# EAGLE design Arduino-Pro-Mini (EAGLE 8.0.1)
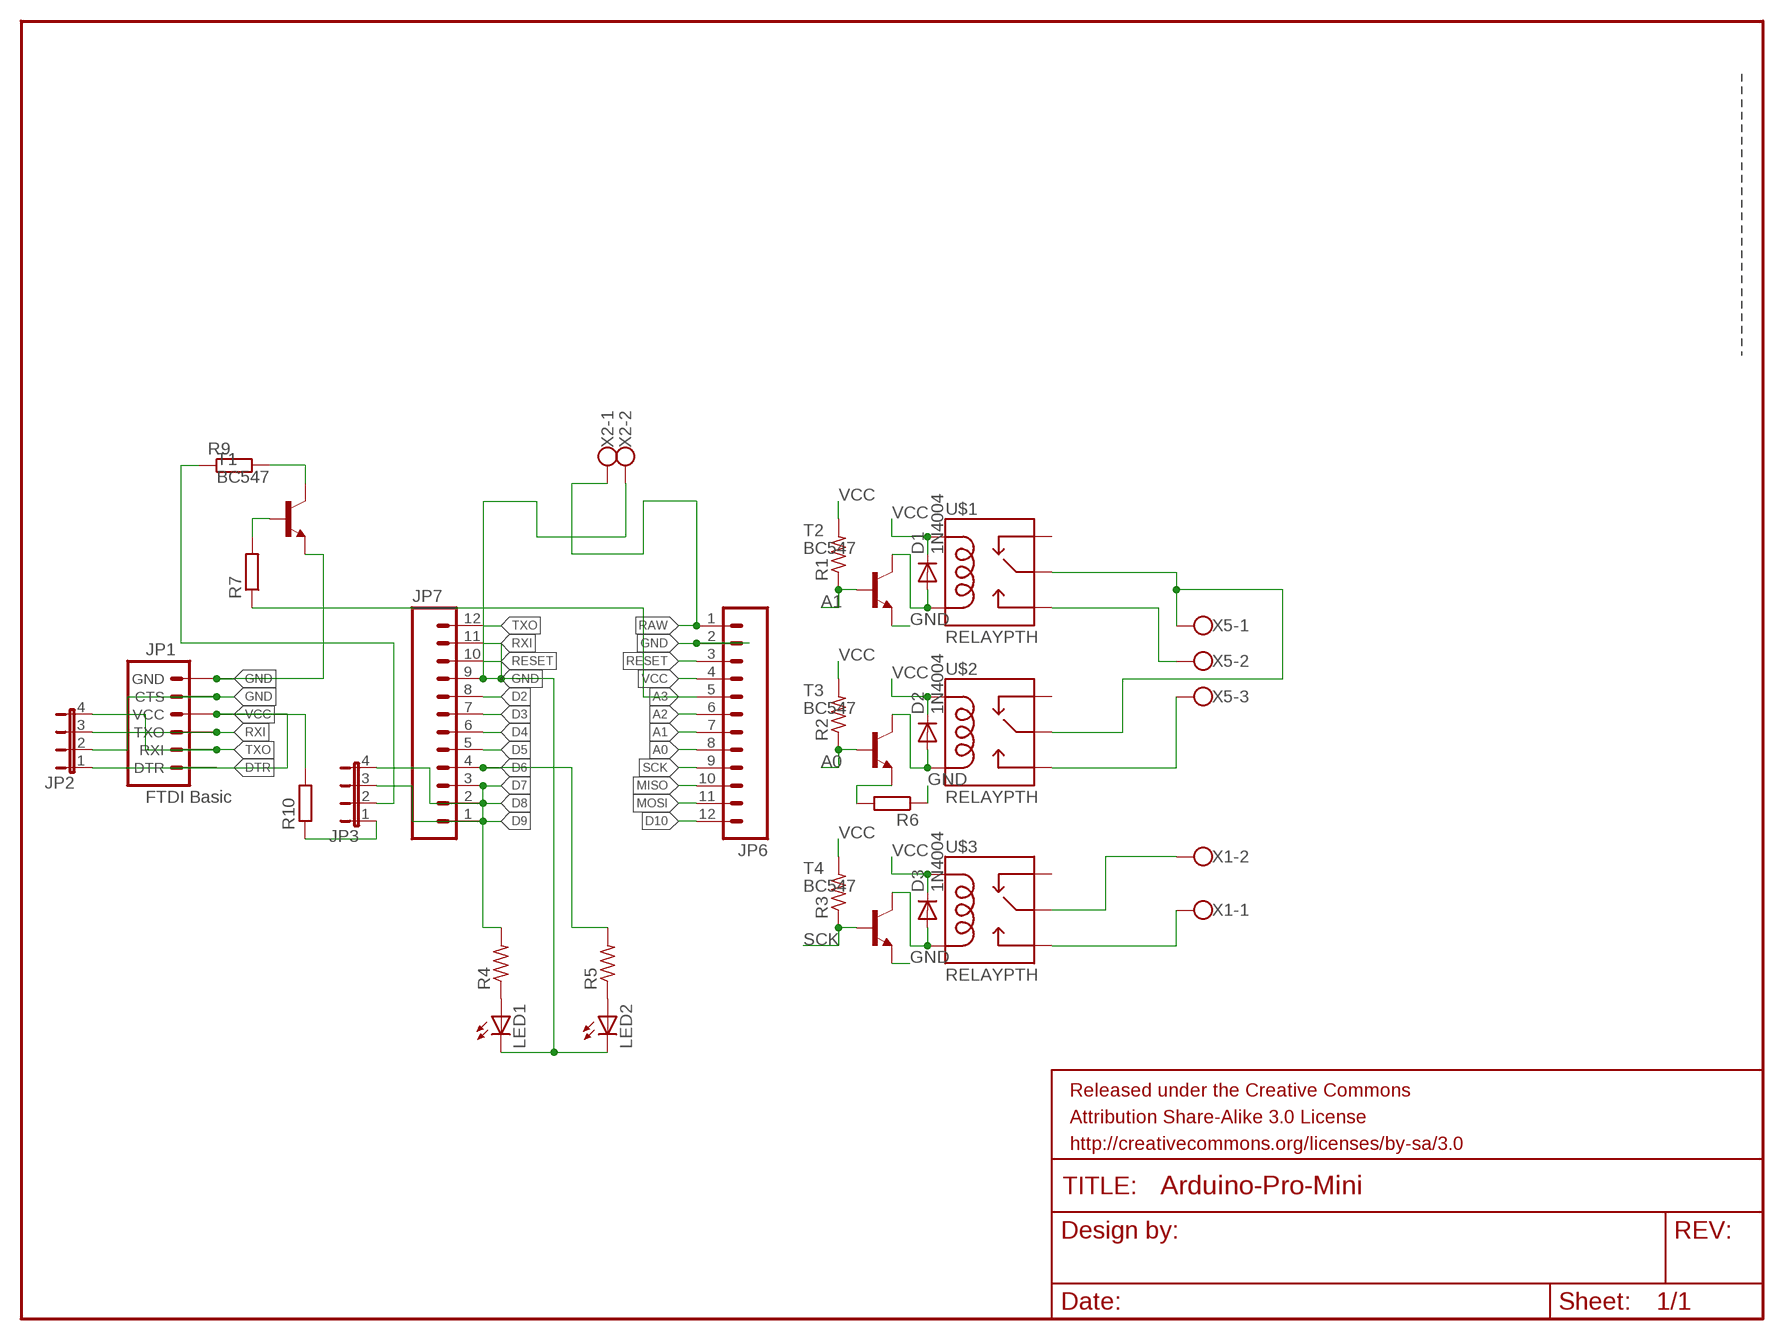
[diagram p0: schematic, sheet 1]

## Parts
D1  1N4004  [DO41-10]
D2  1N4004  [DO41-10]
D3  1N4004  [DO41-10]
FRAME1  FRAME-LETTER  [CREATIVE_COMMONS]
JP1  FTDI Basic  ARDUINO_SERIAL_PROGRAMPTH  [1X06]
JP2  JP4E  [JP4]
JP3  JP4E  [JP4]
JP6  M12PTH  [1X12]
JP7  M12PTH  [1X12]
LED1  LED3MM  [LED3MM]
LED2  LED3MM  [LED3MM]
R1  R-US_0204/5  [0204/5]
R2  R-US_0204/5  [0204/5]
R3  R-US_0204/5  [0204/5]
R4  FLIPFLOP-RES  [0805-THM]
R5  FLIPFLOP-RES  [0805-THM]
R6  RR1206  [R1206]
R7  R0204/7  [0204/7]
R9  RR0603  [R0603]
R10  RR1206  [R1206]
T1  BC547  [TO92]
T2  BC547  [TO92]
T3  BC547  [TO92]
T4  BC547  [TO92]
U$1  RELAYPTH  [SRD-05VDC-SL-C]
U$2  RELAYPTH  [SRD-05VDC-SL-C]
U$3  RELAYPTH  [SRD-05VDC-SL-C]
X1  W237-102  [W237-102]
X2  W237-102  [W237-102]
X5  W237-103  [W237-103]

## Nets
A0: JP6.8 R2.1 T3.2(B)
A1: JP6.7 R1.1 T2.2(B)
A2: JP6.6
A3: JP6.5 R7.1
D2: JP7.8
D3: JP7.7
D4: JP7.6
D5: JP7.5
D6: JP7.4 R5.2
D7: JP7.3 R4.2
D8: JP3.4 JP7.2
D9: JP3.3 JP7.1
D10: JP6.12
DTR: JP1.1(DTR)
GND [vcc]: JP1.5(CTS) JP1.6(GND) JP2.2 JP6.2 JP7.9 LED1.K(C) LED2.K(C) R6.1 R6.2 T1.1(E) T2.1(E) T3.1(E) T4.1(E) X2.2
MISO: JP6.10
MOSI: JP6.11
N$1: U$1.SWCOMMON U$2.SWCOMMON X5.1
N$2: U$1.SWOPEN X5.2
N$3: U$2.SWOPEN X5.3
N$4: D3.A T4.3(C) U$3.COIL0
N$5: D2.A T3.3(C) U$2.COIL0
N$6: D1.A T2.3(C) U$1.COIL0
N$7: U$3.SWCOMMON X1.2
N$8: U$3.SWOPEN X1.1
N$10: LED1.A R4.1
N$11: LED2.A R5.1
N$13: JP3.2 R9.1
N$14: R7.2 T1.2(B)
N$15: JP3.1 R10.1
N$16: R9.2 T1.3(C)
RAW [vcc]: JP6.1 X2.1
RESET: JP6.3 JP7.10
RXI: JP1.3(TXO) JP2.3 JP7.11
SCK: JP6.9 R3.1 T4.2(B)
TXO: JP1.2(RXI) JP2.4 JP7.12
VCC: D1.C D2.C D3.C JP1.4(VCC) JP2.1 JP6.4 R1.2 R2.2 R3.2 R10.2 U$1.COIL1 U$2.COIL1 U$3.COIL1
Unconnected: U$1.SWCLOSED(SWCLOSE) U$2.SWCLOSED(SWCLOSE) U$3.SWCLOSED(SWCLOSE)

## Library data of the parts
D1-D3 = adafruit:1N4004: DIODE General purpose 1N400x type rectifier (With bigger pads) http://www.ladyada.net/library/pcb/eaglelibrary.html
FRAME1 = SparkFun-Aesthetics:FRAME-LETTER: Schematic Frame Standard 8.5x11 US Letter frame
JP1 = SparkFun:ARDUINO_SERIAL_PROGRAM
JP2 JP3 = jumper:JP4E: JUMPER
JP6 JP7 = SparkFun:M12: Header 12 Standard 12-pin 0.1" header. Use with straight break away headers (SKU : PRT-00116), right angle break away headers (PRT-00553), swiss pins (PRT-00743), machine pins (PRT-00117), and female headers (PRT-00115).
LED1 LED2 = led:LED: LED OSRAM: - CHIPLED LG R971, LG N971, LY N971, LG Q971, LY Q971, LO R971, LY R971 LH N974, LH R974 LS Q976, LO Q976, LY Q976 LO Q996 - Hyper CHIPLED LW Q18S LB Q993, LB Q99A, LB R99A - SideLED LS A670, LO A670, LY A670, LG A670, LP A670 LB A673, LV A673, LT A673, LW A673 LH A674 LY A675 LS A676, LA A676, LO A676, LY A676, LW A676 LS A679, LY A679, LG A679 - Hyper Micro SIDELED® LS Y876, LA Y876, LO Y876, LY Y876 LT Y87S - SmartLED LW L88C, LW L88S LB L89C, LB L89S, LG L890 LS L89K, LO L89K, LY L89K LS L896, LA L896, LO L896, LY L896 - TOPLED LS T670, LO T670, LY T670, LG T670, LP T670 LSG T670, LSP T670, LSY T670, LOP T670, LYG T670 LG T671, LOG T671, LSG T671 LB T673, LV T673, LT T673, LW T673 LH T674 LS T676, LA T676, LO T676, LY T676, LB T676, LH T676, LSB T676, LW T676 LB T67C, LV T67C, LT T67C, LS T67K, LO T67K, LY T67K, LW E67C LS E67B, LA E67B, LO E67B, LY E67B, LB E67C, LV E67C, LT E67C LW T67C LS T679, LY T679, LG T679 LS T770, LO T770, LY T770, LG T770, LP T770 LB T773, LV T773, LT T773, LW T773 LH T774 LS E675, LA E675, LY E675, LS T675 LS T776, LA T776, LO T776, LY T776, LB T776 LHGB T686 LT T68C, LB T68C - Hyper Mini TOPLED® LB M676 - Mini TOPLED Santana® LG M470 LS M47K, LO M47K, LY M47K Source: http://www.osram.convergy.de LUXEON: - LUMILED® LXK2-PW12-R00, LXK2-PW12-S00, LXK2-PW14-U00, LXK2-PW14-V00 LXK2-PM12-R00, LXK2-PM12-S00, LXK2-PM14-U00 LXK2-PE12-Q00, LXK2-PE12-R00, LXK2-PE12-S00, LXK2-PE14-T00, LXK2-PE14-U00 LXK2-PB12-K00, LXK2-PB12-L00, LXK2-PB12-M00, LXK2-PB14-N00, LXK2-PB14-P00, LXK2-PB14-Q00 LXK2-PR12-L00, LXK2-PR12-M00, LXK2-PR14-Q00, LXK2-PR14-R00 LXK2-PD12-Q00, LXK2-PD12-R00, LXK2-PD12-S00 LXK2-PH12-R00, LXK2-PH12-S00 LXK2-PL12-P00, LXK2-PL12-Q00, LXK2-PL12-R00 Source: www.luxeon.com KINGBRIGHT: KA-3528ASYC Source: www.kingbright.com
R1-R3 = adafruit:R-US_: RESISTOR, American symbol
R4 R5 = adafruit:FLIPFLOP-RES: Flip Flop resistor An 0805 resistor inside a standard 1/4W 5% resistor. Makes for easy mods
R6 R7 R9 R10 = eagle-ltspice:R: RESISTOR, European symbol; SPICEMODEL: NONE; SPICEPREFIX: R
T1-T4 = transistor:BC547: NPN TRANSISTOR
U$1-U$3 = SRD-05VDC-SL-C:RELAY: SPDT relay (COM-00101)
X1 X2 = con-wago-500:W237-102: WAGO SCREW CLAMP; MPN: 237-102; OC_FARNELL: unknown; OC_NEWARK: 70K9898
X5 = con-wago-500:W237-103: WAGO SCREW CLAMP; MPN: 237-103; OC_FARNELL: unknown; OC_NEWARK: 18M7116

## Net classes
0 default: width 0.203 mm
1 vcc: width 0.254 mm

## Board
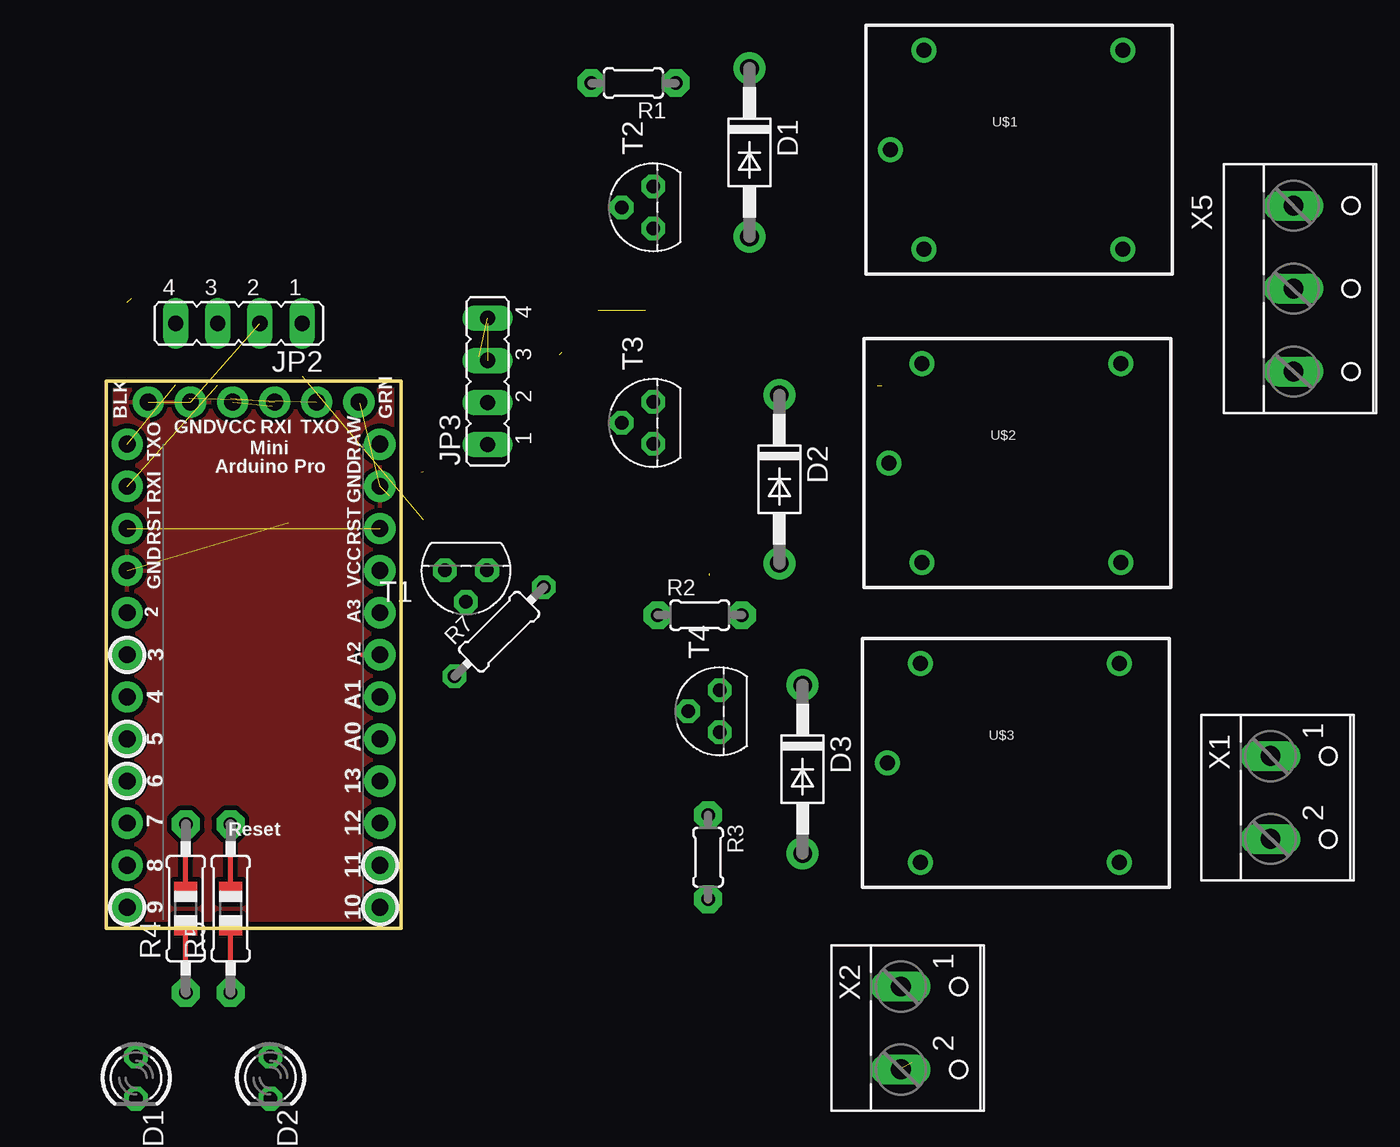
[diagram p1: board, top side]
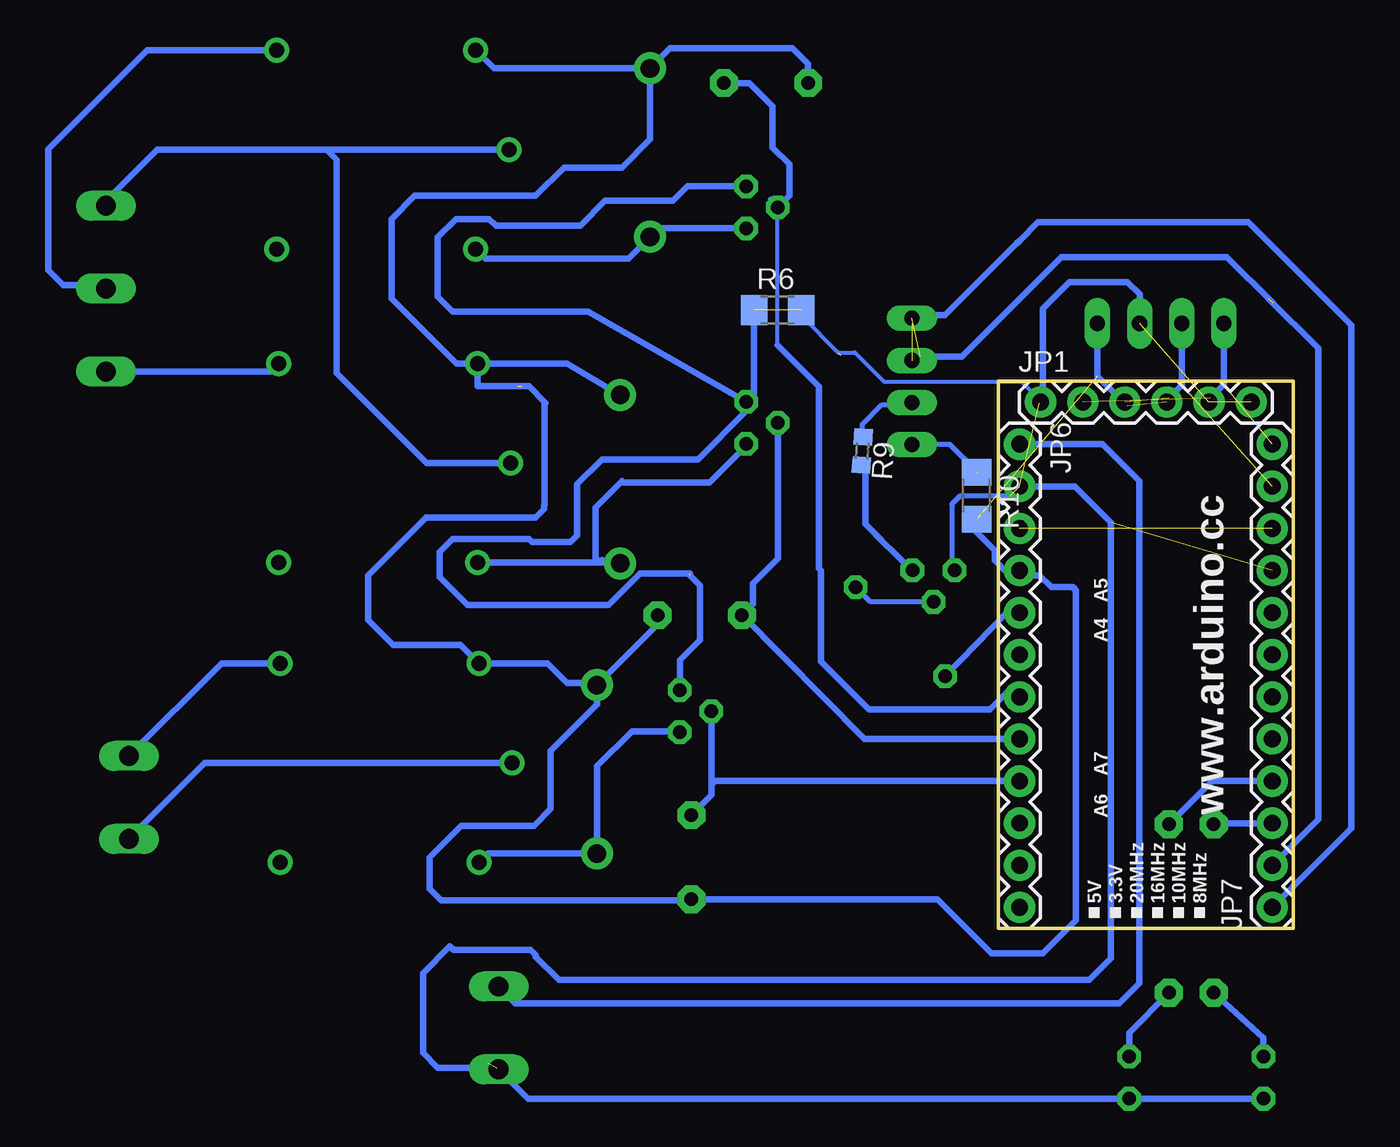
[diagram p2: board, bottom side, seen from below]

Size 17.78 x 33.02 mm. Coordinates in mm from the lower left corner, seen from the top.
Outline: 0,33.02 0,0 17.78,0 17.78,33.02 0,33.02
Copper layers (1*16): Top 0.035mm / dielectric 1.5mm / Bottom 0.035mm
Design rules "SparkFun-2-layer *": minimum track width 7mil, minimum drill 15mil, track to track 8mil, track to pad 8mil, pad to pad 8mil, via to via 8mil, smd to smd 8mil, copper to edge 8mil, drill to drill 8mil, minimum pad ring 12mil, minimum via ring 10mil, stop-mask expansion 4mil, vias tented up to drill 20mil, thermal gap 10mil

### Footprints (pad centres in the part's own frame; a part is rotated, then mirrored left to right if it is on the bottom)
DO41-10 = drill 1.118 pad 1.93: A 5.08,0; C -5.08,0
1X06 = drill 1.016 pad 1.88: 1 0,0; 2 2.54,0; 3 5.08,0; 4 7.62,0; 5 10.16,0; 6 12.7,0
JP4 = drill 0.914 long: 1 -3.81,0; 2 -1.27,0; 3 1.27,0; 4 3.81,0
1X12 = drill 1.016 pad 1.88: 1 0,0; 2 2.54,0; 3 5.08,0; 4 7.62,0; 5 10.16,0; 6 12.7,0; 7 15.24,0; 8 17.78,0; 9 20.32,0; 10 22.86,0; 11 25.4,0; 12 27.94,0
LED3MM = drill 0.813 octagon: A -1.27,0; K 1.27,0
0204/5 = drill 0.813 pad 1.676 octagon: 1 -2.54,0; 2 2.54,0
0805-THM = drill 0.813 pad 1.676 octagon: 1 -5.08,0; 2 5.08,0
R1206 = smd 1.6 x 1.803: 1 -1.422,0; 2 1.422,0
0204/7 = drill 0.813 octagon: 1 -3.81,0; 2 3.81,0
R0603 = smd 1 x 1.1: 1 -0.85,0; 2 0.85,0
TO92 = drill 0.813 octagon: 1 1.27,0; 2 0,1.905; 3 -1.27,0
SRD-05VDC-SL-C = drill 0.9: COIL0 -5.39,-6.12; COIL1 -5.39,5.88; SWCLOSED 6.61,-6.12; SWCOMMON -7.39,-0.12; SWOPEN 6.61,5.88
W237-102 = drill 1.194 long: 1 -2.5,-1.27; 2 2.5,-1.27
W237-103 = drill 1.194 long: 1 -5,-1.29; 2 0,-1.29; 3 5,-1.29

### Placement (x,y rotation side)
D1  38.8,46.8 270 top  (outside the outline)
D2  40.6,27.1 270 top  (outside the outline)
D3  42,9.6 270 top  (outside the outline)
FRAME1  -13.48,-9.39 0 top  (outside the outline)
JP1  15.24,31.75 0 bottom
JP2  8,36.5 180 top  (outside the outline)
JP3  23,33 90 top  (outside the outline)
JP6  16.51,29.21 270 bottom
JP7  1.27,1.27 90 bottom
LED1  1.8,-9 270 top  (outside the outline)
LED2  9.9,-9 270 top  (outside the outline)
R1  31.8,51 180 top  (outside the outline)
R2  35.8,18.9 0 top  (outside the outline)
R3  36.3,4.3 270 top  (outside the outline)
R4  4.8,1.2 90 top
R5  7.5,1.2 90 top
R6  31.1,37.3 0 bottom  (outside the outline)
R7  23.7,17.9 45 top  (outside the outline)
R9  26,28.8 266.3 bottom  (outside the outline)
R10  19.1,26.1 270 bottom
T1  21.7,21.6 180 top
T2  33,43.5 90 top  (outside the outline)
T3  33,30.5 90 top  (outside the outline)
T4  37,13.1 90 top  (outside the outline)
U$1  54.7,47.1 0 top  (outside the outline)
U$2  54.6,28.2 0 top  (outside the outline)
U$3  54.5,10.1 0 top  (outside the outline)
X1  71.5,7.9 270 top  (outside the outline)
X2  49.2,-6 270 top  (outside the outline)
X5  72.9,38.6 270 top  (outside the outline)

### Tracks (layer width: path | path; a pad name or v marks a point on that pad's centre or on a via)
A0
  Bottom 0.406: JP6.8 25.87,11.43 R2.1 32.6,19.56 32.6,20.8 31.09,22.3 T3.2
A1
  Bottom 0.254: 31.1,35.2 31.1,43.54 31.52,43.95
  Bottom 0.406: 31.52,43.95 T2.2 30.4,44.2 30.4,46.1 31.4,47.1 31.4,49.6 32.8,51 R1.1 | JP6.7 16.74,14.2 17.3,14.2 18.3,13.2 25.6,13.2 28.5,16.1 28.5,21.6 28.6,21.7 28.6,32.7 31.1,35.2
A2
  Top 0.254: 15.39,16.51 JP6.6
A3
  Top 0.254: 16.51,18.76 JP6.5 16.51,18.76
  Bottom 0.406: JP6.5 17.26,19.05 R7.1
D6
  Bottom 0.406: JP7.4 4.89,8.89 R5.2
D7
  Bottom 0.406: JP7.3 4.15,6.35 4.8,5.7 R4.2
D8  (2 unrouted)
  Bottom 0.406: 1.5,38 -1.5,35 -1.5,6.58 JP7.2 | 1.25,37.75 4,40.5 14,40.5 20,34.5 22.5,34.5 23,34
D9  (1 unrouted)
  Bottom 0.406: JP7.1 -3.5,6.04 -3.5,36.4 2.7,42.6 15.4,42.6 16.5,41.5 16.7,41.3 21,37 22.5,37 23,36.5
GND  (9 unrouted)
  Bottom 0.254: R6.2 29.68,36.98 27.45,34.75 26.45,34.75 24.7,33 16.4,33 15.1,31.7
  Bottom 0.305: 17.08,26.1 20.1,26.1 20.6,25.6 20.6,21.77 T1.1
  Bottom 0.406: JP2.2 9.27,38.27 10,39 13.5,39 15.1,37.4 15.1,31.7 15.3,31.7 15.2,31.8 | LED1.K LED2.K 46.16,-10.27 X2.2 48.03,-8.4 51.6,-8.4 52.5,-7.5 52.5,-2.7 50.88,-1.08 50.66,-1.3 46,-1.3 45.7,-1.6 45.7,-1.7 44.3,-3.1 12.3,-3.1 11,-1.8 11,24.5 13.17,26.67 JP6.2 | 48.9,-8.4 48.6,-8.1 | 36.4,21.3 35.8,20.7 35.8,17.4 37,16.2 T4.1 37,14.5 | T2.1 36.53,44.77 37.4,43.9 41.5,43.9 43,42.4 48.1,42.4 48.5,42.8 50.5,42.8 51.6,41.7 51.6,38.1 50.7,37.2 42.53,37.2 T3.1 | 36.4,21.4 39.4,21.4 41.3,19.5 49.8,19.5 51.5,21.2 51.5,22.7 50.7,23.5 46.1,23.5 45.9,23.3 43.6,23.3 43.2,23.7 43.2,26.8 41.7,28.3 35.9,28.3 33,31.2 T3.1 | R6.1 32.52,32.25 T3.1
  pour Top (isolate 0.305): 0,33.02 17.78,33.02 17.78,0 0,0
N$1
  Bottom 0.406: 58.3,46.98 U$1.SWCOMMON | 58.3,46.98 68.52,46.98 72.2,43.3 71.91,43.3 X5.1 | U$2.SWCOMMON 52.28,28.08 57.7,33.5 57.7,46.38 58.3,46.98
N$2
  Bottom 0.406: U$1.SWOPEN 69.12,52.98 75.1,47 75.1,39.7 74.2,38.8 71.81,38.8 X5.2
N$3
  Bottom 0.406: X5.3 61.69,33.6 U$2.SWOPEN
N$4
  Bottom 0.406: U$3.COIL0 48.57,4.52 D3.A 42,9.8 39.9,11.9 37.07,11.9 T4.3
N$5
  Bottom 0.406: U$2.COIL0 41.96,22.08 D2.A | 41.7,22.22 D2.A | D2.A 42.1,22.22 42.1,25.4 40.5,27 40.4,26.9 35.2,26.9 33,29.1 T3.3
N$6
  Bottom 0.406: T2.3 38.29,42.23 D1.A 38.8,41.7 40.1,40.4 48.73,40.4 U$1.COIL0
N$7
  Bottom 0.406: U$3.SWCOMMON 65.65,9.98 X1.2
N$8
  Bottom 0.406: U$3.SWOPEN 64.65,15.98 X1.1
N$10
  Bottom 0.406: LED1.A 1.8,-6.58 R4.1
N$11
  Bottom 0.406: R5.1 9.9,-6.28 LED2.A
N$13
  Bottom 0.305: R9.1 26,30.4 24.8,31.6 23.13,31.6 JP3.2
N$14
  Bottom 0.305: T1.2 25.5,19.7 R7.2
N$15  (1 unrouted)
  Bottom 0.305: 19,27.5 20.7,29.2 JP3.1
N$16
  Bottom 0.406: T1.3 24.87,23.43 | 24.87,23.43 25.15,23.7 | 24.87,23.43 24.87,23.47 25.8,24.4 25.8,27.7 R9.2
RAW
  Bottom 0.406: JP6.1 11.51,29.21 9.3,27 9.3,-3.3 10.5,-4.5 46.93,-4.5 X2.1
RESET  (1 unrouted)
RXI  (2 unrouted)
  Bottom 0.406: JP2.3 6.73,32.77 7.5,32
SCK
  Bottom 0.406: 35.09,8.7 T4.2 | 35.09,8.7 35.09,8.04 R3.1 | 35.09,8.7 34.91,8.89 JP6.9
TXO  (2 unrouted)
  Bottom 0.406: JP2.4 4.19,32.81 5,32
VCC  (3 unrouted)
  Bottom 0.406: JP2.1 11.81,33.31 10,31.5 | R10.2 19.1,23.9 18,22.8 18,22.2 17.3,21.5 16.6,21.5 JP6.4 16.22,21.3 15.3,21.3 14.6,20.6 13.3,20.6 13.1,20.4 13.1,0.5 15.1,-1.5 18.2,-1.5 21.46,1.76 R3.2 36.36,1.7 51.4,1.7 52.1,2.4 52.1,4.3 50.2,6.2 45.8,6.2 44.8,7.2 44.8,10.7 42,13.5 D3.C | D3.C 42.12,14.8 43.8,14.8 44.98,15.98 U$3.COIL1 50.23,17.1 54.3,17.1 55.8,18.6 55.8,21.3 52.3,24.8 45.7,24.8 45.2,25.3 45.2,25.5 45.15,25.55 45.15,31.75 | U$2.COIL1 43.8,34.08 D2.C | U$2.COIL1 50.48,34.08 54.4,38 54.4,42.8 53,44.2 45.7,44.2 44,45.9 40.5,45.9 38.8,47.6 D1.C | R2.2 38.34,18.34 D3.C | R1.2 29.26,52.16 30.2,53.1 37.58,53.1 D1.C | D1.C 48.21,51.88 U$1.COIL1 | U$2.COIL1 49.21,32.71 46.51,32.71 | 46.8,32.71 46.11,32.71 45.15,31.75 | 45.15,31.75 45.1,31.7

### Text on the board
tPlace: BLK | GRN | GND | VCC | RXI | TXO | Mini | TXO | RAW | Arduino Pro | RXI | GND | RST | RST | VCC | GND | 2 | A3 | 3 | A2 | 4 | A1 | 5 | A0 | 6 | 13 | 7 | Reset | 12 | 8 | 11 | 9 | 10
bPlace: A5 | A4 | A7 | www.arduino.cc | A6 | 8MHz | 10MHz | 16MHz | 20MHz | 3.3V | 5V
tValues: Valid combinations: | 168V / 3.3V Reg / 8MHz | 168 / 5V Reg / 16MHz | 168 / 5V Reg / 20MHz | Mark back accordingly | Arduino Pro Mini
tDocu: Original Arduino Mini Design by Team Arduino / Arduino Pro Mini Design by SparkFun Electronics / Revised by Pete Lewis